# EAGLE design 1DD-17-mk-1.0.1 (EAGLE 7.5.0)
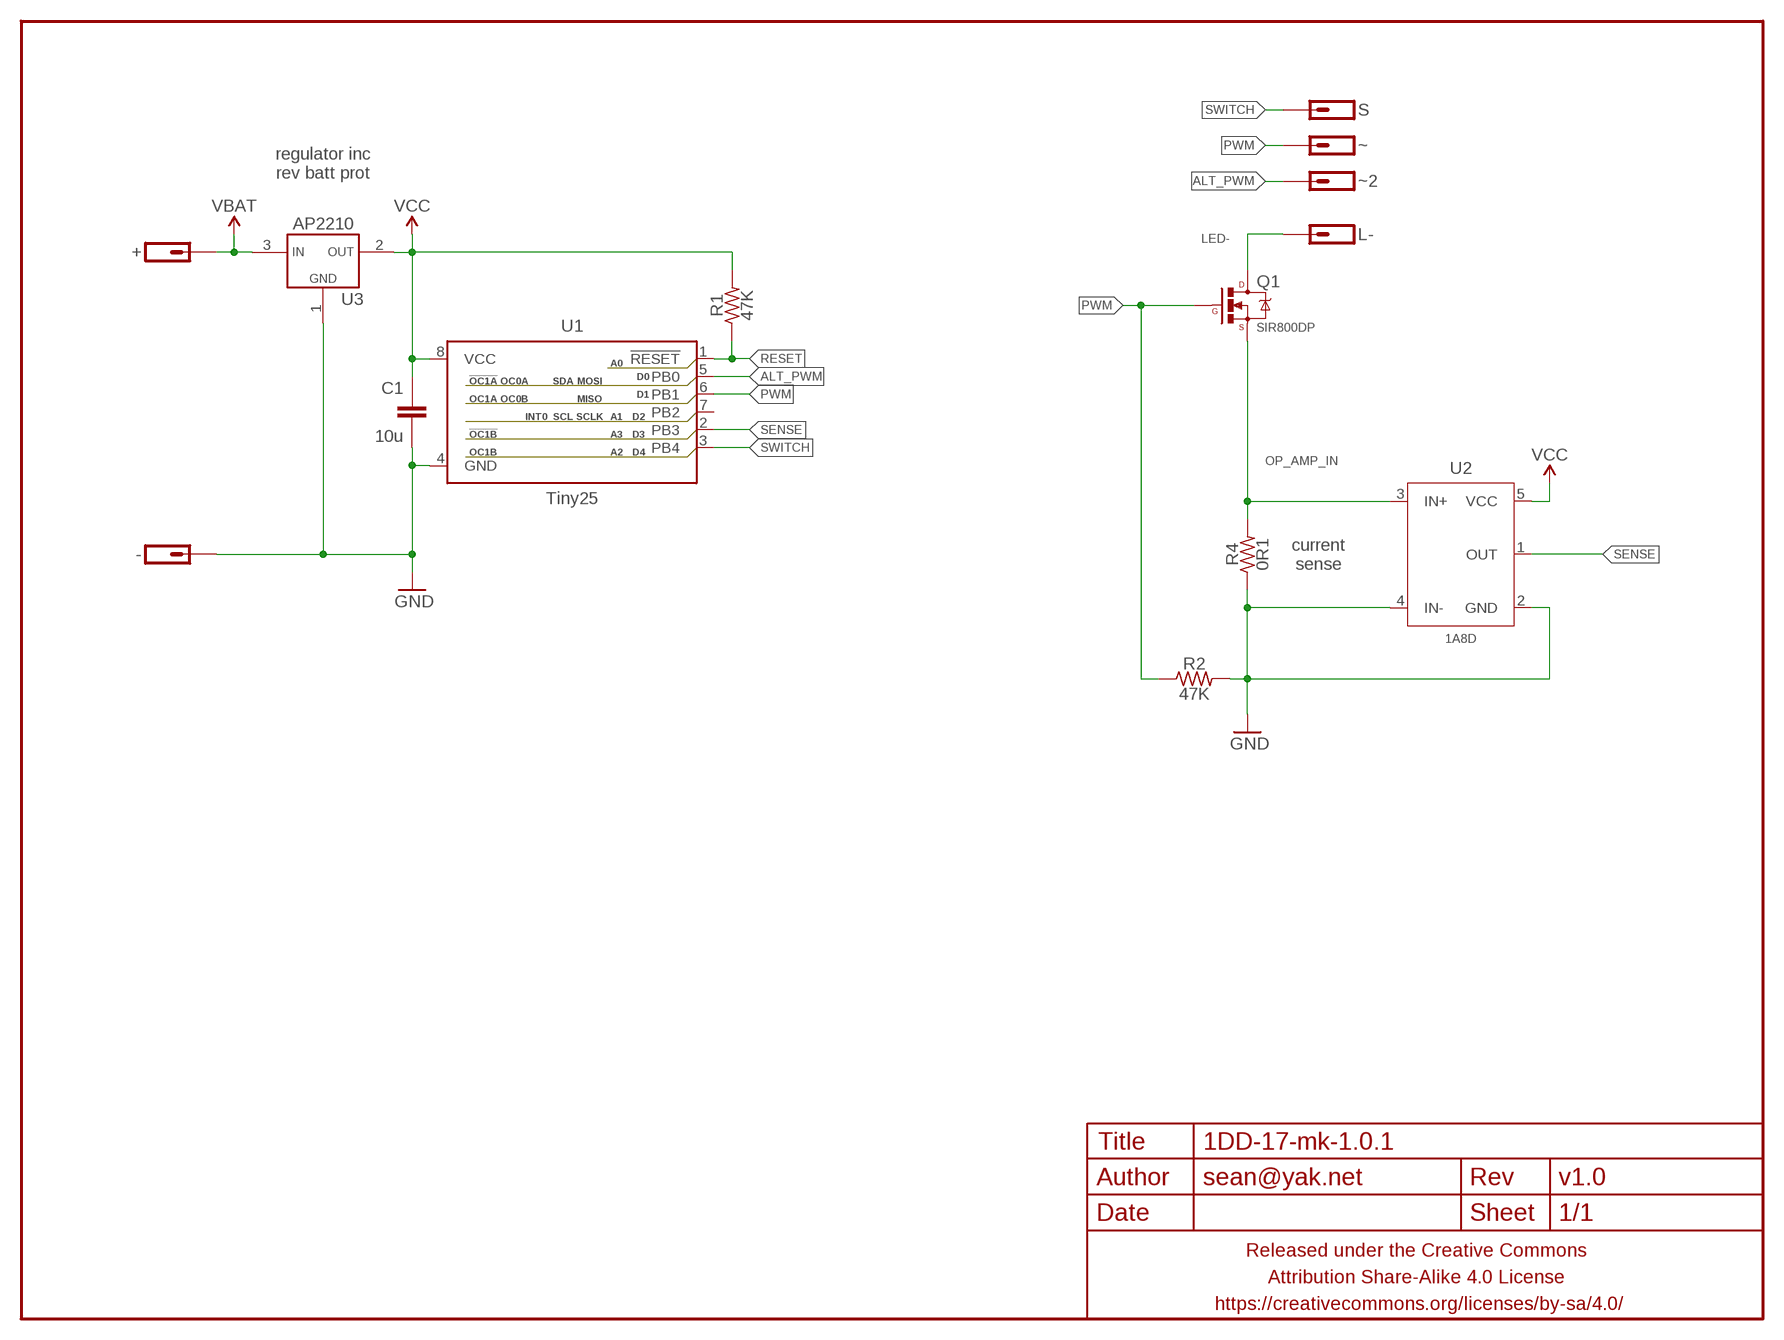
[diagram p0: schematic, sheet 1]

## Parts
+  M01PTH-1MM-CIR-NS  [1X01-1MM-CIR-NS]
-  M01NOT-A-VIA-NOPE  [1X01_NOSILK_NOSTOP]
C1  10u  CAPACITOR-CERAMICC0603-TIGHTER  [C0603-TIGHTER]
FRAME1  FRAME-LETTERNO_PACKAGE  [DUMMY]
L-  M01SMD-1.5MM-DIA-NS  [1X01-SMD-1.5MM-DIA-NS]
Q1  SIR800DP  MOSFET-NCHANNELSIR800DP  [POWERPACK-SO-8]
R1  47K  RESISTORR0402  [R0402]
R2  47K  RESISTORR0402  [R0402]
R4  0R1  RESISTORR1206  [R1206]
S  M01SMD-1MM-DIA-NS  [1X01-SMD-1MM-DIA-NS]
U1  Tiny25  ATTINY13SOIC-NARROWPADS  [SO08-NARROWER]
U2  1A8D  INA180DBV-ALT  [SOT23-5-SLIM]
U3  AP2210  AP2210SOT23-SMALLER  [SOT23-3]
~  M01SMD-1MM-DIA-NS  [1X01-SMD-1MM-DIA-NS]
~2  M01SMD-1MM-DIA-NS  [1X01-SMD-1MM-DIA-NS]

## Nets
ALT_PWM: U1.5(PB0) ~2.P$1
GND: -.P$1 C1.2 R2.2 R4.1 U1.4(GND) U2.2(GND) U2.4(IN-) U3.1(GND)
LED-: L-.P$1 Q1.5678(D)
OP_AMP_IN: Q1.1(S) Q1.2(S) Q1.3(S) R4.2 U2.3(IN+)
PWM: Q1.4(G) R2.1 U1.6(PB1) ~.P$1
RESET: R1.1 U1.1(!RESET)
SENSE: U1.2(PB3) U2.1(OUT)
SWITCH: S.P$1 U1.3(PB4)
VBAT: +.1 U3.3(VIN)
VCC: C1.1 R1.2 U1.8(VCC) U2.5(VCC) U3.2(VOUT)
Unconnected: U1.7(PB2)

## Notes on the sheet
- regulator inc
  rev batt prot
- current
  sense

## Library data of the parts
+ - L- S ~ ~2 = a_parts:M01: Header 1 Standard 1-pin 0.1" header. Use with straight break away headers (SKU : PRT-00116), right angle break away headers (PRT-00553), swiss pins (PRT-00743), machine pins (PRT-00117), and female headers (PRT-00115).
C1 = a_parts:CAPACITOR-CERAMIC: CAPACITOR, European symbol
FRAME1 = a_parts:FRAME-LETTER: Schematic Frame Standard 8.5x11 US Letter frame; DESIGNER: sean@yak.net; VERSION: v1.0
Q1 = a_parts:MOSFET-NCHANNEL: Common NMOSFET Parts MFG P/N Store ID Prod ID FDD8780 TRANS-09984 SI7820DN TRANS-11055 FDS6630A IC-08089 2N7002PW TRANS-11151 FQP30N06L COM-10213 TRANS-10060 BSS123LT1G TRANS-08345 BSS138 TRANS-00830 BS170 2N7000
R1 R2 R4 = a_parts:RESISTOR: RESISTOR, American symbol
U1 = a_parts:ATTINY13: Atmel 8-pin 1kB flash uC
U2 = a_parts:INA180
U3 = a_parts:AP2210

## Board
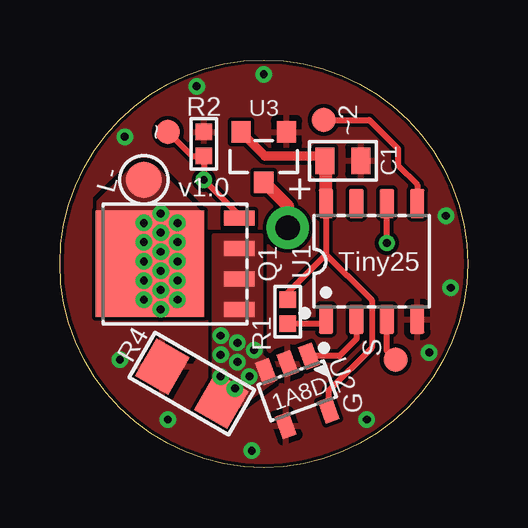
[diagram p1: board, top side]
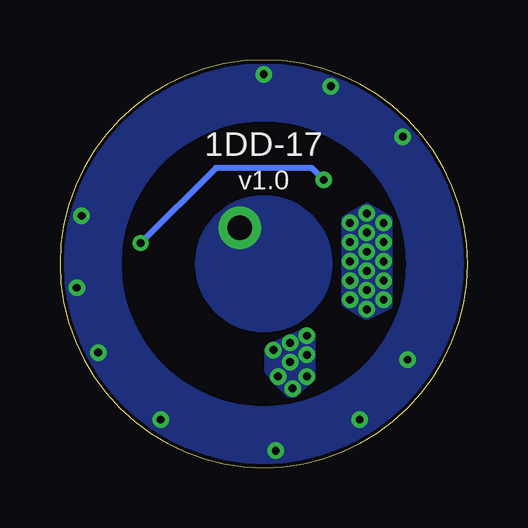
[diagram p2: board, bottom side, seen from below]

Size 17 x 17 mm. Coordinates in mm from the lower left corner, seen from the top.
Outline: 0,8.5 arc-180 17,8.5 arc-180 0,8.5
Copper layers (1*16): Top 0.0356mm / dielectric 1.5011mm / Bottom 0.0356mm
Design rules "LaenPCBOrder2 *": minimum track width 6mil, minimum drill 13mil, track to track 6mil, track to pad 6mil, pad to pad 6mil, via to via 6mil, smd to smd 6mil, copper to edge 6mil, drill to drill 6mil, minimum pad ring 7mil, minimum via ring 7mil, stop-mask expansion 3mil, vias tented up to drill 20mil, thermal gap 10mil

### Footprints (pad centres in the part's own frame; a part is rotated, then mirrored left to right if it is on the bottom)
1X01-1MM-CIR-NS = drill 1.016 pad 1.778: 1 0,0
1X01_NOSILK_NOSTOP = drill 0.33: P$1 0,0
C0603-TIGHTER = smd 0.8 x 1.1: 1 -0.75,0; 2 0.75,0
1X01-SMD-1.5MM-DIA-NS = smd 1.5 x 1.5: P$1 0,0
POWERPACK-SO-8 = smd 1.27 x 0.61: 1 -2.67,1.905; 2 -2.67,0.635; 3 -2.67,-0.635; 4 -2.67,-1.905 | smd 4.52 x 4.42: 5678 1.045,0
R0402 = smd 0.7 x 0.7: 1 -0.5,0; 2 0.5,0
R1206 = smd 1.6 x 1.8: 1 -1.42,0; 2 1.42,0
1X01-SMD-1MM-DIA-NS = smd 1 x 1: P$1 0,0
SO08-NARROWER = smd 0.6 x 1.2: 1 -1.905,-2.416; 2 -0.635,-2.416; 3 0.635,-2.416; 4 1.905,-2.416; 5 1.905,2.416; 6 0.635,2.416; 7 -0.635,2.416; 8 -1.905,2.416
SOT23-5-SLIM = smd 0.6 x 1: 1 -0.95,-1.2; 2 0,-1.2; 3 0.95,-1.2; 4 0.95,1.2; 5 -0.95,1.2
SOT23-3 = smd 0.8 x 0.9: 1 -0.95,-1; 2 0.95,-1; 3 0,1.1

### Placement (x,y rotation side)
+  9.5,10 0 top
-  2.5,4.5 90 bottom
C1  11.8,12.8 0 top
FRAME1  0,0 0 top
L-  3.5,12 270 top
Q1  4.8,8.5 180 top
R1  9.5,6.5 90 top
R2  6,13.5 90 top
R4  5.5,3.5 330 top
S  14,4.5 180 top
U1  13,8.6 0 top
U2  9.9,3.2 200 top
U3  8.5,13 180 top
~  4.5,14 270 top
~2  11,14.5 270 top

### Tracks (layer width: path | path; a pad name or v marks a point on that pad's centre or on a via)
ALT_PWM
  Top 0.25: ~2.P$1 12.9,14.5 14.1,13.3 14.1,12.6 14.9,11.8 U1.5
GND  (via drill 0.33)
  other vias: 8.5,16.4 5.7,15.9 2.7,13.8 4.5,2 8,0.7 12.8,2 15.4,4.8 16.3,7.5 16.1,10.5
  pour Bottom (isolate 0.152, rank 6, no thermals): 0,8.5 2.5,8.5 arc90 8.5,2.5 arc90 14.5,8.5 17,8.5 arc-90 8.5,0 arc-90
  pour Top (isolate 0.152, rank 6): 17,0 17,17 0,17 0,0
  pour Bottom (isolate 0.152, rank 6, no thermals): 17,8.5 14.5,8.5 arc90 8.5,14.5 arc90 2.5,8.5 0,8.5 arc-90 8.5,17 arc-90
LED-  (via drill 0.33)
  other vias: 3.5,7 3.5,7.8 3.5,8.6 3.5,9.4 3.5,10.2 4.2,7.4 4.2,8.2 4.2,9 4.2,9.8 4.2,10.6 4.2,6.6 4.9,7 4.9,7.8 4.9,8.6 4.9,9.4 4.9,10.2
  pour Top (isolate 0.152, no thermals): 3,12.5 4,12.5 5.9,10.6 5.9,6.4 1.6,6.4 1.6,11.1
  pour Bottom (isolate 0.152, rank 2, no thermals): 3.2,10.4 3.2,6.7 4.2,6.2 5.2,6.8 5.2,10.4 4.2,11
OP_AMP_IN  (via drill 0.33)
  other vias: 6.7,5.5 6.7,4.7 8.1,4.9 7.4,5.2 7.4,4.4 6.7,3.8 7.9,3.8 7.3,3.3
  pour Top (isolate 0.152, no thermals): 6.4,9.7 8.4,9.7 8.4,4.7 8.7,4.4 8.9,3.7 8.9,3.6 7.4,2.5 7,2 6.5,2 6,2.5 6.1,3.1 6.4,3.4
  pour Bottom (isolate 0.152, rank 2, no thermals): 6.7,5.8 8.3,5.1 8.4,4.9 8.4,4 8,3.5 7.5,3 7.2,3 6.4,3.7 6.4,5.6
PWM  (via drill 0.33)
  Top 0.25: ~.P$1 5.5,13 R2.1 v6,12 7.47,10.53 Q1.4 | v13.63,9.37 U1.6
  Bottom 0.25: v6,12 6.5,12.5 10.5,12.5 v13.63,9.37
RESET
  Top 0.25: U1.1 10.91,6 R1.1
SENSE
  Top 0.25: U1.2 12.37,5.37 11.65,4.65 U2.1
SWITCH
  Top 0.25: S.P$1 13.63,4.87 U1.3
VBAT
  Top 0.55: +.1 9.5,10.9 U3.3
  pour Bottom (isolate 0.152, no thermals): 5.7,8.5 arc-180 11.3,8.5 arc-180
VCC
  Top 0.25: U1.8 11.1,8.89 | 11.1,8.89 11.99,8 12,8 13,7 13,5 11.2,3.2 U2.5 | 11.1,8.89 9.5,7.3 R1.2
  Top 0.4: U3.2 8.55,13 10.85,13 C1.1
  Top 0.55: U1.8 11.1,12.76 C1.1

### Text on the board
tPlace: G
bPlace: 1DD-17